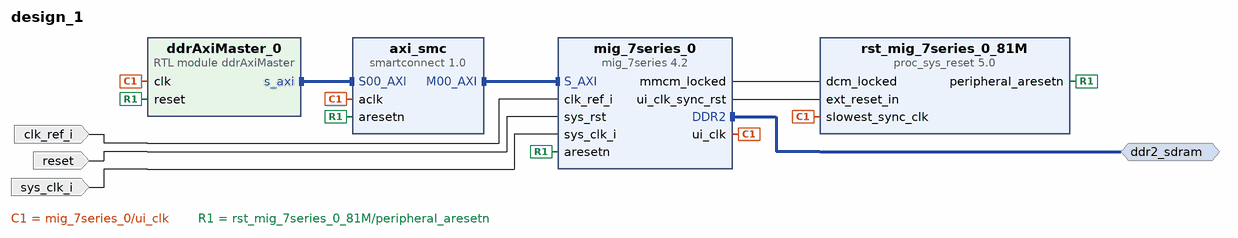
[diagram p0: block diagram of the top level]
# Vivado block design design_1, xc7a100tcsg324-1, Vivado 2021.2
create_bd_design design_1

create_bd_intf_port -mode Master -vlnv xilinx.com:interface:ddrx_rtl:1.0 ddr2_sdram
create_bd_port -dir I -type clk clk_ref_i
create_bd_port -dir I -type clk sys_clk_i
create_bd_port -dir I -type rst reset
set_property -dict {CONFIG.POLARITY ACTIVE_LOW} [get_bd_ports reset]

create_bd_cell -type ip -vlnv xilinx.com:ip:mig_7series:4.2 mig_7series_0
set_property -dict {CONFIG.BOARD_MIG_PARAM ddr2_sdram CONFIG.RESET_BOARD_INTERFACE reset} [get_bd_cells mig_7series_0]
create_bd_cell -type module -reference ddrAxiMaster ddrAxiMaster_0
create_bd_cell -type ip -vlnv xilinx.com:ip:smartconnect:1.0 axi_smc
set_property -dict {CONFIG.NUM_SI 1} [get_bd_cells axi_smc]
create_bd_cell -type ip -vlnv xilinx.com:ip:proc_sys_reset:5.0 rst_mig_7series_0_81M

# ---- connections ----

connect_bd_intf_net [get_bd_intf_pins axi_smc/M00_AXI] [get_bd_intf_pins mig_7series_0/S_AXI]
connect_bd_intf_net [get_bd_intf_pins ddrAxiMaster_0/s_axi] [get_bd_intf_pins axi_smc/S00_AXI]
connect_bd_intf_net [get_bd_intf_ports ddr2_sdram] [get_bd_intf_pins mig_7series_0/DDR2]
connect_bd_net [get_bd_ports clk_ref_i] [get_bd_pins mig_7series_0/clk_ref_i]
connect_bd_net [get_bd_pins mig_7series_0/mmcm_locked] [get_bd_pins rst_mig_7series_0_81M/dcm_locked]
connect_bd_net [get_bd_pins mig_7series_0/ui_clk] \
  [get_bd_pins axi_smc/aclk] [get_bd_pins rst_mig_7series_0_81M/slowest_sync_clk] [get_bd_pins ddrAxiMaster_0/clk]
connect_bd_net [get_bd_pins mig_7series_0/ui_clk_sync_rst] [get_bd_pins rst_mig_7series_0_81M/ext_reset_in]
connect_bd_net [get_bd_ports reset] [get_bd_pins mig_7series_0/sys_rst]
connect_bd_net [get_bd_pins rst_mig_7series_0_81M/peripheral_aresetn] \
  [get_bd_pins mig_7series_0/aresetn] [get_bd_pins ddrAxiMaster_0/reset] [get_bd_pins axi_smc/aresetn]
connect_bd_net [get_bd_ports sys_clk_i] [get_bd_pins mig_7series_0/sys_clk_i]

# ---- address map ----
assign_bd_address -offset 0x0000000 -range 128M -target_address_space [get_bd_addr_spaces ddrAxiMaster_0/s_axi] [get_bd_addr_segs mig_7series_0/memmap/memaddr]

validate_bd_design
save_bd_design
